# Altium schematic sheet ESP32-WROVER Dev Board.SchDoc: ESP32-WROVER Breakout Board
size A4; Author: Sawyer Rempel; Revision: A; SheetNumber: 1; SheetTotal: 1
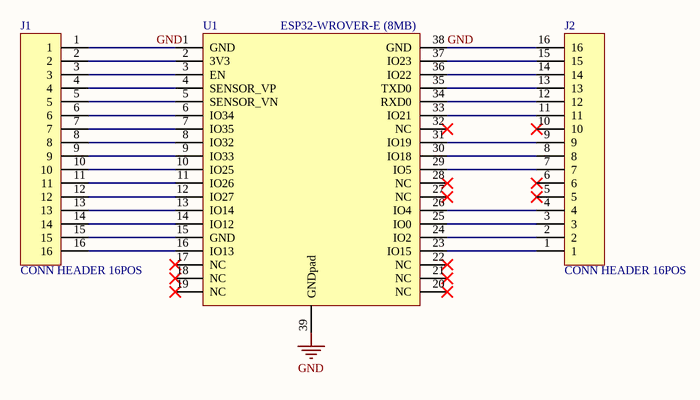
[diagram p0: ESP32-WROVER Dev Board.SchDoc]

## Parts
J1  CONN HEADER 16POS  [CONN HEADER 16POS]
J2  CONN HEADER 16POS  [CONN HEADER 16POS]
U1  ESP32-WROVER-E (8MB)  [ESP32-WROVER-E (8MB)]

## Nets
GND: J1.1 J2.16 U1.1(GND) U1.38(GND) U1.39(GNDpad)
NetJ1_2: J1.2 U1.2(3V3)
NetJ1_3: J1.3 U1.3(EN)
NetJ1_4: J1.4 U1.4(SENSOR_VP)
NetJ1_5: J1.5 U1.5(SENSOR_VN)
NetJ1_6: J1.6 U1.6(IO34)
NetJ1_7: J1.7 U1.7(IO35)
NetJ1_8: J1.8 U1.8(IO32)
NetJ1_9: J1.9 U1.9(IO33)
NetJ1_10: J1.10 U1.10(IO25)
NetJ1_11: J1.11 U1.11(IO26)
NetJ1_12: J1.12 U1.12(IO27)
NetJ1_13: J1.13 U1.13(IO14)
NetJ1_14: J1.14 U1.14(IO12)
NetJ1_15: J1.15 U1.15(GND)
NetJ1_16: J1.16 U1.16(IO13)
NetJ2_1: J2.1 U1.23(IO15)
NetJ2_2: J2.2 U1.24(IO2)
NetJ2_3: J2.3 U1.25(IO0)
NetJ2_4: J2.4 U1.26(IO4)
NetJ2_7: J2.7 U1.29(IO5)
NetJ2_8: J2.8 U1.30(IO18)
NetJ2_9: J2.9 U1.31(IO19)
NetJ2_11: J2.11 U1.33(IO21)
NetJ2_12: J2.12 U1.34(RXD0)
NetJ2_13: J2.13 U1.35(TXD0)
NetJ2_14: J2.14 U1.36(IO22)
NetJ2_15: J2.15 U1.37(IO23)

Not connected (* = marked no-connect by the designer): J2 5* 6* 10*; U1 17(NC)* 18(NC)* 19(NC)* 20(NC)* 21(NC)* 22(NC)* 27(NC)* 28(NC)* 32(NC)*

## Notes on the sheet
- Real-Time Railway Track Condition Monitoring
- Drawn By:
- Size:
- A4
- Revision:
- Sheet:
- of